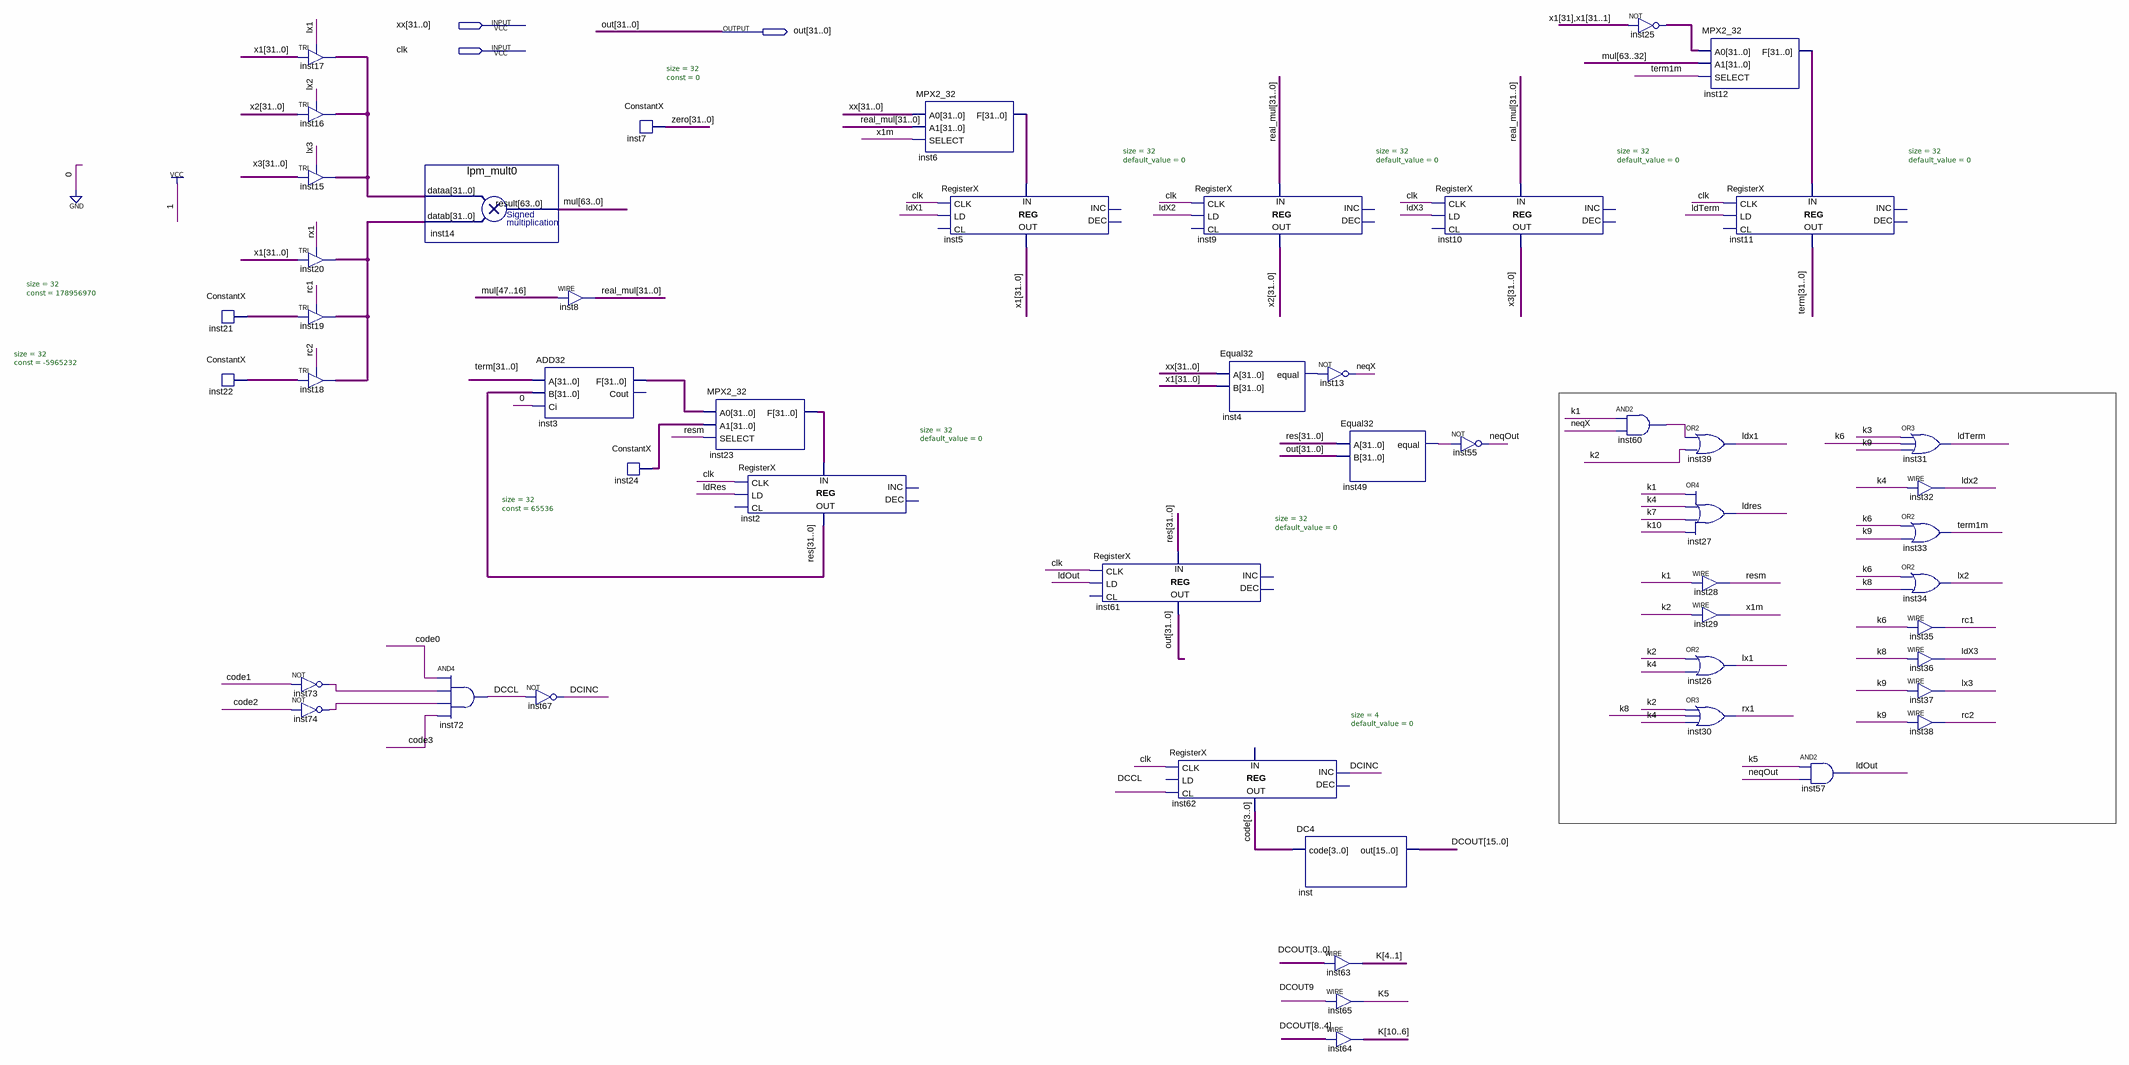
[diagram p0: schematic sheet]
// Quartus schematic CosTaylorSeq.bdf as structural Verilog: 52 symbols, 3 pins
module CosTaylorSeq (
  input  [31:0] xx,
  input  clk,
  output [31:0] out
);

  wire DCCL, DCINC, inst4_equal, inst49_equal, inst60_out, inst73_out, inst74_out, k5, ldOut, ldRes, ldTerm,
       ldX1, ldX2, ldX3, lx1, lx2, lx3, neqOut, neqX, rc1, rc2, resm, rx1, term1m, x1m;
  wire [3:0] code;
  wire [10:1] K;
  wire [15:0] DCOUT;
  wire [31:0] inst3_f, inst6_f, inst12_f, inst17_out, inst20_out, inst21_data_out, inst22_data_out, inst23_f,
       inst24_data_out, inst25_out, real_mul, res, term, x1, x2, x3, zero;
  wire [63:0] mul;

  ConstantX #(.size(32), .\const (178956970)) inst21 (.DATA_OUT(inst21_data_out));
  ConstantX #(.size(32), .\const (-5965232)) inst22 (.DATA_OUT(inst22_data_out));
  TRI inst17[31:0] (.IN(x1), .OE(lx1), .OUT(inst17_out));
  TRI inst16[31:0] (.IN(x2), .OE(lx2), .OUT(inst17_out));
  TRI inst15[31:0] (.IN(x3), .OE(lx3), .OUT(inst17_out));
  TRI inst20[31:0] (.IN(x1), .OE(rx1), .OUT(inst20_out));
  TRI inst19[31:0] (.IN(inst21_data_out), .OE(rc1), .OUT(inst20_out));
  TRI inst18[31:0] (.IN(inst22_data_out), .OE(rc2), .OUT(inst20_out));
  not inst73 (inst73_out, code[1]);
  not inst74 (inst74_out, code[2]);
  lpm_mult0 inst14 (.dataa(inst17_out), .datab(inst20_out), .result(mul));
  and inst72 (DCCL, code[0], inst73_out, inst74_out, code[3]);
  assign real_mul = mul[47:16];  // WIRE inst8
  ADD32 inst3 (.A(term), .B(res), .Ci(1'b0), .F(inst3_f));  // open: Cout
  not inst67 (DCINC, DCCL);
  ConstantX #(.size(32), .\const (65536)) inst24 (.DATA_OUT(inst24_data_out));
  ConstantX #(.size(32), .\const (0)) inst7 (.DATA_OUT(zero));
  MPX2_32 inst23 (.A0(inst3_f), .A1(inst24_data_out), .SELECT(resm), .F(inst23_f));
  RegisterX #(.size(32), .default_value(0)) inst2 (
    .CLK(clk), .LD(ldRes), .DATA_IN(inst23_f), .DATA_OUT(res));  // open: CL, INC, DEC
  MPX2_32 inst6 (.A0(xx), .A1(real_mul), .SELECT(x1m), .F(inst6_f));
  RegisterX #(.size(32), .default_value(0)) inst5 (
    .CLK(clk), .LD(ldX1), .DATA_IN(inst6_f), .DATA_OUT(x1));  // open: CL, INC, DEC
  RegisterX #(.size(32), .default_value(0)) inst61 (
    .CLK(clk), .LD(ldOut), .DATA_IN(res), .DATA_OUT(out));  // open: CL, INC, DEC
  RegisterX #(.size(4), .default_value(0)) inst62 (
    .CLK(clk), .CL(DCCL), .INC(DCINC), .DATA_OUT(code));  // open: LD, DEC, DATA_IN
  RegisterX #(.size(32), .default_value(0)) inst9 (
    .CLK(clk), .LD(ldX2), .DATA_IN(real_mul), .DATA_OUT(x2));  // open: CL, INC, DEC
  Equal32 inst4 (.A(xx), .B(x1), .equal(inst4_equal));
  not inst13 (neqX, inst4_equal);
  DC4 inst (.code(code), .out(DCOUT));
  assign K[4:1] = DCOUT[3:0];  // WIRE inst63
  assign k5 = DCOUT[9];  // WIRE inst65
  assign K[10:6] = DCOUT[8:4];  // WIRE inst64
  Equal32 inst49 (.A(res), .B(out), .equal(inst49_equal));
  RegisterX #(.size(32), .default_value(0)) inst10 (
    .CLK(clk), .LD(ldX3), .DATA_IN(real_mul), .DATA_OUT(x3));  // open: CL, INC, DEC
  not inst55 (neqOut, inst49_equal);
  assign inst25_out = ~{{2{x1[31]}}, x1[30:1]};  // NOT inst25, 32 bits wide
  and inst60 (inst60_out, K[1], neqX);
  MPX2_32 inst12 (.A0(inst25_out), .A1(mul[63:32]), .SELECT(term1m), .F(inst12_f));
  RegisterX #(.size(32), .default_value(0)) inst11 (
    .CLK(clk), .LD(ldTerm), .DATA_IN(inst12_f), .DATA_OUT(term));  // open: CL, INC, DEC
  or inst39 (ldX1, inst60_out, K[2]);
  or inst27 (ldRes, K[1], K[4], K[7], K[10]);
  assign resm = K[1];  // WIRE inst28
  assign x1m = K[2];  // WIRE inst29
  or inst26 (lx1, K[2], K[4]);
  or inst30 (rx1, K[2], K[8], K[4]);
  and inst57 (ldOut, k5, neqOut);
  or inst31 (ldTerm, K[3], K[6], K[9]);
  assign ldX2 = K[4];  // WIRE inst32
  or inst33 (term1m, K[6], K[9]);
  or inst34 (lx2, K[6], K[8]);
  assign rc1 = K[6];  // WIRE inst35
  assign ldX3 = K[8];  // WIRE inst36
  assign lx3 = K[9];  // WIRE inst37
  assign rc2 = K[9];  // WIRE inst38
endmodule
